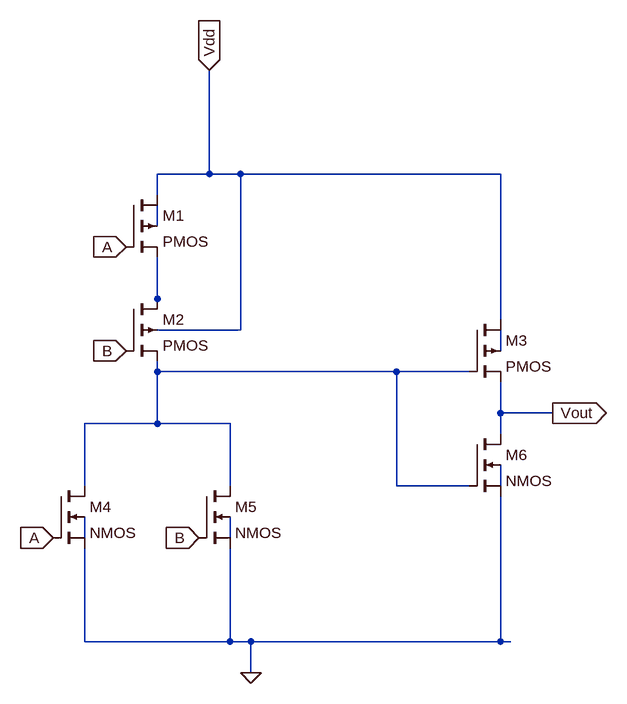
[diagram p0: schematic or2.asc]
or2.asc, the LTspice schematic file:
Version 4.1
SHEET 1 960 680
WIRE 320 -224 320 -384
WIRE 320 -224 240 -224
WIRE 368 -224 320 -224
WIRE 768 -224 368 -224
WIRE 240 -192 240 -224
WIRE 240 -144 240 -176
WIRE 240 -32 240 -96
WIRE 240 -16 240 -32
WIRE 768 0 768 -224
WIRE 368 16 368 -224
WIRE 368 16 240 16
WIRE 768 48 768 16
WIRE 240 80 240 64
WIRE 608 80 240 80
WIRE 720 80 608 80
WIRE 768 144 768 96
WIRE 848 144 768 144
WIRE 240 160 240 80
WIRE 240 160 128 160
WIRE 352 160 240 160
WIRE 768 176 768 144
WIRE 128 256 128 160
WIRE 352 256 352 160
WIRE 608 256 608 80
WIRE 720 256 608 256
WIRE 768 256 768 224
WIRE 128 336 128 304
WIRE 352 336 352 304
WIRE 128 496 128 352
WIRE 352 496 352 352
WIRE 352 496 128 496
WIRE 384 496 352 496
WIRE 768 496 768 272
WIRE 768 496 384 496
WIRE 784 496 768 496
WIRE 384 544 384 496
FLAG 192 -112 A
IOPIN 192 -112 In
FLAG 80 336 A
IOPIN 80 336 In
FLAG 192 48 B
IOPIN 192 48 In
FLAG 304 336 B
IOPIN 304 336 In
FLAG 848 144 Vout
IOPIN 848 144 Out
FLAG 384 544 0
FLAG 320 -384 Vdd
IOPIN 320 -384 In
SYMBOL pmos4 192 -192 R0
SYMATTR InstName M1
SYMATTR Value2 l=180n w=1600n
SYMBOL pmos4 192 -32 R0
SYMATTR InstName M2
SYMATTR Value2 l=180n w=1600n
SYMBOL pmos4 720 0 R0
SYMATTR InstName M3
SYMATTR Value2 l=180n w=800n
SYMBOL nmos4 80 256 R0
SYMATTR InstName M4
SYMATTR Value2 l=180n w=400n
SYMBOL nmos4 304 256 R0
SYMATTR InstName M5
SYMATTR Value2 l=180n w=400n
SYMBOL nmos4 720 176 R0
SYMATTR InstName M6
SYMATTR Value2 l=180n w=400n

The netlist it stands for:
* or2.asc
M1 Vdd A N002 N001 PMOS l=180n w=1600n
M2 N002 B N004 Vdd PMOS l=180n w=1600n
M3 Vdd N004 Vout N003 PMOS l=180n w=800n
M4 N004 A 0 N006 NMOS l=180n w=400n
M5 N004 B 0 N007 NMOS l=180n w=400n
M6 Vout N004 0 N005 NMOS l=180n w=400n
.model NMOS NMOS
.model PMOS PMOS
.lib standard.mos
.backanno
.end